# Altium schematic sheet main.SchDoc: 33c3 Heißer Draht
size Legal; Organization: Niklas Fauth; Revision: V1.0; SheetNumber: 1; SheetTotal: 1; File: bla
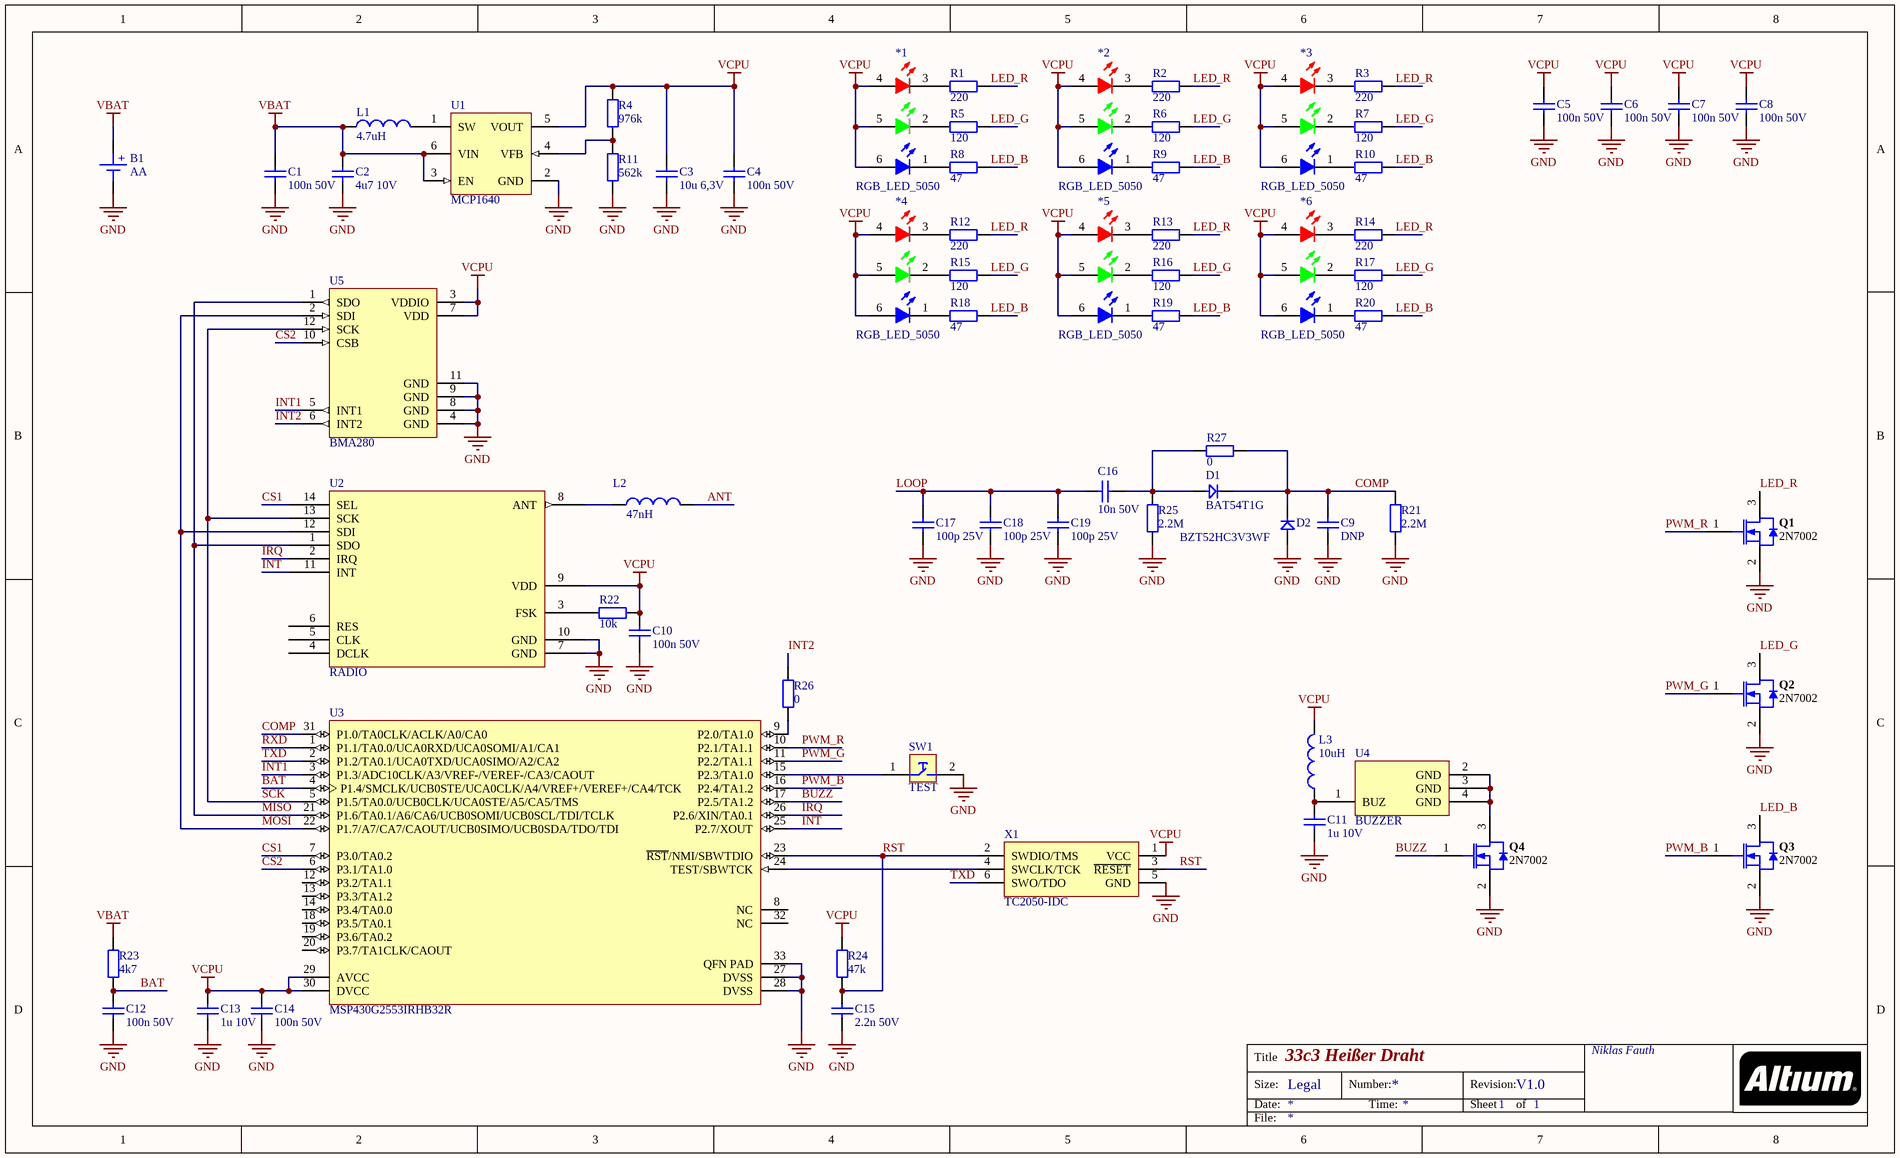
[diagram p0: main.SchDoc]

## Parts
*1  RGB_LED_5050  [plcc6]
*2  RGB_LED_5050  [plcc6]
*3  RGB_LED_5050  [plcc6]
*4  RGB_LED_5050  [plcc6]
*5  RGB_LED_5050  [plcc6]
*6  RGB_LED_5050  [plcc6]
B1  AA  [AA-HOLDER]
C1  100n 50V  [C-0603-M]
C2  4u7 10V  [C-0603-H]
C3  10u 6,3V  [C-0603-H]
C4  100n 50V  [C-0603-M]
C5  100n 50V  [C-0603-M]
C6  100n 50V  [C-0603-M]
C7  100n 50V  [C-0603-M]
C8  100n 50V  [C-0603-M]
C9  DNP  [C-0603-H]
C10  100n 50V  [C-0603-M]
C11  1u 10V  [C-0603-H]
C12  100n 50V  [C-0603-M]
C13  1u 10V  [C-0603-H]
C14  100n 50V  [C-0603-M]
C15  2.2n 50V  [C-0603-H]
C16  10n 50V  [C-0603-H]
C17  100p 25V  [C-0603-M]
C18  100p 25V  [C-0603-M]
C19  100p 25V  [C-0603-M]
D1  BAT54T1G  [SOD123]
D2  BZT52HC3V3WF  [SOD123]
L1  4.7uH  [SRN4012]
L2  47nH  [C-0603-M]
L3  10uH  [R-0805]
Q1  2N7002  [INF-PG-SOT23_M]
Q2  2N7002  [INF-PG-SOT23_M]
Q3  2N7002  [INF-PG-SOT23_M]
Q4  2N7002  [INF-PG-SOT23_M]
R1  220  [R-0603-M]
R2  220  [R-0603-M]
R3  220  [R-0603-M]
R4  976k  [R-0603-M]
R5  120  [R-0603-M]
R6  120  [R-0603-M]
R7  120  [R-0603-M]
R8  47  [R-0603-M]
R9  47  [R-0603-M]
R10  47  [R-0603-M]
R11  562k  [R-0603-M]
R12  220  [R-0603-M]
R13  220  [R-0603-M]
R14  220  [R-0603-M]
R15  120  [R-0603-M]
R16  120  [R-0603-M]
R17  120  [R-0603-M]
R18  47  [R-0603-M]
R19  47  [R-0603-M]
R20  47  [R-0603-M]
R21  2.2M  [R-0603-H]
R22  10k  [R-0603-M]
R23  4k7  [R-0603-H]
R24  47k  [R-0603-H]
R25  2.2M  [R-0603-H]
R26  0  [R-0603-M]
R27  0  [R-0603-M]
SW1  TEST  [switch-mini-ALPS]
U1  MCP1640  [SOT23-6]
U2  RADIO  [RFM12]
U3  MSP430G2553IRHB32R  [RHB0032E_V]
U4  BUZZER  [PIEZO]
U5  BMA280  [LGA12C50P4X4_203X203X80]
X1  TC2050-IDC  [TC2030-IDC-NL]

## Nets
GND: B1.1 C1.1 C2.1 C3.1 C4.1 C5.1 C6.1 C7.1 C8.1 C9.1 C10.1 C11.1 C12.1 C13.1 C14.1 C15.1 C17.1 C18.1 C19.1 D2.1(an) Q1.2(SOURCE) Q2.2(SOURCE) Q3.2(SOURCE) Q4.2(SOURCE) R11.1 R21.1 R25.1 SW1.2 U1.2(GND) U2.7(GND) U2.10(GND) U3.27(DVSS) U3.28(DVSS) U3.33(QFN_PAD) U5.4(GND) U5.8(GND) U5.9(GND) U5.11(GND) X1.5(GND)
VBAT: B1.2 C1.2 C2.2 L1.1 R23.2 U1.3(EN) U1.6(VIN)
VCPU: *1.4(A) *1.5(A) *1.6(A) *2.4(A) *2.5(A) *2.6(A) *3.4(A) *3.5(A) *3.6(A) *4.4(A) *4.5(A) *4.6(A) *5.4(A) *5.5(A) *5.6(A) *6.4(A) *6.5(A) *6.6(A) C3.2 C4.2 C5.2 C6.2 C7.2 C8.2 C10.2 C13.2 C14.2 L3.2 R4.2 R22.2 R24.2 U1.5(VOUT) U2.9(VDD) U3.29(AVCC) U3.30(DVCC) U5.3(VDDIO) U5.7(VDD) X1.1(VCC)
ANT: L2.2
BAT: C12.2 R23.1 U3.4(P1.4/SMCLK/UCB0STE/UCA0CLK/A4/VREF+/VEREF+/CA4/TCK)
BUZZ: Q4.1(GATE) U3.17(P2.5/TA1.2)
COMP: C9.2 D1.2(kt) D2.2(kt) R21.2 R27.2 U3.31(P1.0/TA0CLK/ACLK/A0/CA0)
CS1: U2.14(SEL) U3.7(P3.0/TA0.2)
CS2: U3.6(P3.1/TA1.0) U5.10(CSB)
INT: U2.11(INT) U3.25(P2.7/XOUT)
INT1: U3.3(P1.3/ADC10CLK/A3/VREF-/VEREF-/CA3/CAOUT) U5.5(INT1)
INT2: R26.2 U5.6(INT2)
IRQ: U2.2(IRQ) U3.26(P2.6/XIN/TA0.1)
LED_B: Q3.3(DRAIN) R8.2 R9.2 R10.2 R18.2 R19.2 R20.2
LED_G: Q2.3(DRAIN) R5.2 R6.2 R7.2 R15.2 R16.2 R17.2
LED_R: Q1.3(DRAIN) R1.2 R2.2 R3.2 R12.2 R13.2 R14.2
LOOP: C16.1 C17.2 C18.2 C19.2
MISO: U2.1(SDO) U3.21(P1.6/TA0.1/A6/CA6/UCB0SOMI/UCB0SCL/TDI/TCLK) U5.1(SDO)
MOSI: U2.12(SDI) U3.22(P1.7/A7/CA7/CAOUT/UCB0SIMO/UCB0SDA/TDO/TDI) U5.2(SDI)
PWM_B: Q3.1(GATE) U3.16(P2.4/TA1.2)
PWM_G: Q2.1(GATE) U3.11(P2.2/TA1.1)
PWM_R: Q1.1(GATE) U3.10(P2.1/TA1.1)
RST: C15.2 R24.1 U3.23(~{RST}/NMI/SBWTDIO) X1.2(SWDIO/TMS) X1.3(~{RESET})
RXD: U3.1(P1.1/TA0.0/UCA0RXD/UCA0SOMI/A1/CA1)
SCK: U2.13(SCK) U3.5(P1.5/TA0.0/UCB0CLK/UCA0STE/A5/CA5/TMS) U5.12(SCK)
TXD: U3.2(P1.2/TA0.1/UCA0TXD/UCA0SIMO/A2/CA2) X1.6(SWO/TDO)
Net*1_1: *1.1(K) R8.1
Net*1_2: *1.2(K) R5.1
Net*1_3: *1.3(K) R1.1
Net*2_1: *2.1(K) R9.1
Net*2_2: *2.2(K) R6.1
Net*2_3: *2.3(K) R2.1
Net*3_1: *3.1(K) R10.1
Net*3_2: *3.2(K) R7.1
Net*3_3: *3.3(K) R3.1
Net*4_1: *4.1(K) R18.1
Net*4_2: *4.2(K) R15.1
Net*4_3: *4.3(K) R12.1
Net*5_1: *5.1(K) R19.1
Net*5_2: *5.2(K) R16.1
Net*5_3: *5.3(K) R13.1
Net*6_1: *6.1(K) R20.1
Net*6_2: *6.2(K) R17.1
Net*6_3: *6.3(K) R14.1
NetC11_2: C11.2 L3.1 U4.1(BUZ)
NetC16_2: C16.2 D1.1(an) R25.2 R27.1
NetL1_2: L1.2 U1.1(SW)
NetL2_1: L2.1 U2.8(ANT)
NetQ4_3: Q4.3(DRAIN) U4.2(GND) U4.3(GND) U4.4(GND)
NetR4_1: R4.1 R11.2 U1.4(VFB)
NetR22_1: R22.1 U2.3(FSK)
NetR26_1: R26.1 U3.9(P2.0/TA1.0)
NetSW1_1: SW1.1 U3.15(P2.3/TA1.0)
NetU3_24: U3.24(TEST/SBWTCK) X1.4(SWCLK/TCK)

Not connected (* = marked no-connect by the designer): U2 4(DCLK) 5(CLK) 6(RES); U3 8(NC) 12(P3.2/TA1.1) 13(P3.3/TA1.2) 14(P3.4/TA0.0) 18(P3.5/TA0.1) 19(P3.6/TA0.2) 20(P3.7/TA1CLK/CAOUT) 32(NC)

## Notes on the sheet
- Title
- Size:
- Date:
- Legal
- Number:
- Time:
- Revision:
- Sheet
- of
- File:
- (in symbol AA-Batt-Holder) +

## Library data of the parts
B1 = AA-Batt-Holder: Batt Holder AA; Supplier 1: Reichelt; Supplier Part Number 1: HALTER 1XAAP
C1 C4-C8 C10 C12 C14 = C-0603-100n-50V: Capacitor 100n 50V; Supplier 1: Mouser; Supplier Part Number 1: 80-C0603C104K5RAUTO
C2 = C-0603-4u7-10V: Capacitor 4.7uF 10V; Supplier 1: Mouser; Supplier Part Number 1: 80-C0603C475K8P
C3 = C-0603-10u-6,3V: Capacitor 10uF 6,3V; Supplier 1: Mouser; Supplier Part Number 1: 80-C0603C106M9P
C9 C16 = C-0603-10n-50V: Capacitor 10nF 50V; Supplier 1: Mouser; Supplier Part Number 1: 80-C0603C103K5RAC
C11 C13 = C-0603-1u-10V: Capacitor 1uF 10V; Supplier 1: Mouser; Supplier Part Number 1: 80-C0603C105K8P
C15 = C-0603-2n2-50V: Capacitor 2.2n 50V; Supplier 1: Mouser; Supplier Part Number 1: 80-C0603C222F5G
C17-C19 = C-0603-100p-25V: Capacitor 100pF 25V; Supplier 1: Mouser; Supplier Part Number 1: 80-C0201C101K3G
D2 = BAT54T1G: Supplier 1: Mouser; Supplier Part Number 1: 863-BAT54T1G
L1 = L-SRN4012TA-4R7M: SRN4012TA-4R7M; Supplier 1: Mouser; Supplier Part Number 1: 652-SRN4012TA-4R7M
L2 = L-0603-47nH: Supplier 1: Mouser; Supplier Part Number 1: 652-CI160808-47NJ
L3 = L-0805-10uH: L 0805 10uH; Supplier 1: Digi-Key; Supplier Part Number 1: 445-6762-1-ND
Q1-Q4 = CMP-1149-00026-1: N-Channel OptiMOS Small-Signal-Transistor, 60 V VDS, 0.3 A ID, -55 to 150 degC, PG-SOT23, Reel, Green; Manufacturer: Infineon; RDS (on) (max) (@4.5V): 4,000 mOhm; VDS (max): 60 V; IDpuls (max): 1.2Â A; QG: 0.4Â nC; RDS (on) (max): 3,000 mOhm; RthJA (max): 250 K/W; ID (max): 0.3Â A; VGS(th) (max): 2.5Â V; VGS(th) (min): 1.5Â V; Green: TRUE; Ptot (max): 0.5Â W; PackageDescription: 3-Pin Small Outline Transistor Package, 2.9 x 1.3 mm Body, 0.95 mm Pitch; Halogen-free: TRUE; ComponentLink2Description: Datasheet; ComponentLink1URL: http://www.infineon.com/; Packing: Reel; DatasheetVersion: Rev. 2.4; PartNumber: 2N7002; PackageReference: PG-SOT23; PackageVersion: Apr-08; ComponentLink3URL: http://www.infineon.com/dgdl/SOT23-Package_Overview.pdf?folderId=db3a30431936bc4b0119532290053c66&fileId=db3a30431936bc4b0119533468123c85; ComponentLink1Description: Manufacturer URL; Mounting Technology: Surface Mount; ComponentLink3Description: Package Specification; ComponentLink2URL: http://www.infineon.com/dgdl/2N7002_Rev2.4.pdf?folderId=db3a3043156fd573011622e10b5c1f67&fileId=db3a304319bc939a0119c2a9461e79e6
R1-R3 R12-R14 = R-0603-220: Resistor 220; Supplier 1: Digi-Key; Supplier Part Number 1: 541-220HTR-ND
R4 = R-0603-976k: Resistor 976k; Resistance: 976k; Supplier 1: Mouser; Supplier Part Number 1: 71-CRCW0603-976K-E3
R5-R7 R15-R17 = R-0603-120: Resistor 120; Supplier 1: Mouser; Supplier Part Number 1: 71-CRCW0603-120-E3
R8-R10 R18-R20 = R-0603-47: Resistor 47; Supplier 1: Mouser; Supplier Part Number 1: 71-CRCW060347R0FKEB
R11 = R-0603-562k: Resistor 562k; Resistance: 562k; Supplier 1: Mouser; Supplier Part Number 1: 71-CRCW0603-562K-E3
R21 R25 = R-0603-2M2: Resistor 2.2M; Supplier 1: Mouser; Supplier Part Number 1: 71-CRCW06032M20FKEA
R22 = R-0603-10k: Resistor 10k; Supplier 1: Mouser; Supplier Part Number 1: 71-CRCW0603-10K-E3
R23 = R-0603-4k7: Resistor 4k7; Supplier 1: Mouser; Supplier Part Number 1: 71-CRCW0603-4.7K-E3
R24 = R-0603-47k: Resistor 4k7; Supplier 1: Mouser; Supplier Part Number 1: 71-CRCW060347K0FKEB
R26 R27 = R-0603-0: Resistor 0; Supplier 1: Mouser; Supplier Part Number 1: 71-CRCW0603-0-E3; Resistance: 0
SW1 = Switch-mini-ALPS: SKQYAAE010; Supplier 1: Mouser; Supplier Part Number 1: 688-SKQYAA
U1 = MCP1640: aaa to 3.3V; Supplier 1: Mouser; Supplier Part Number 1: 579-MCP1640TI/CHY
U2 = RFM12: Sub 1GHz Radio Module
U3 = CMP-0365-01202-2: 16 MHz Mixed Signal Microcontroller with 16 KB Flash, 512 B SRAM and 24 GPIOs, -40 to 85 degC, 32-pin QFN (RHB), Green (RoHS & no Sb/Br); Manufacturer: Texas Instruments; Temp Sensor: Yes; Flash(KB): 16; ADC Channels: 8; ADC: 10-bit SAR; SubFamily: Value Line; GPIO: 24; USCI_B (I2C & SPI): 1; Timers - 16-bit: 2; SRAM(B): 512; PackageReference: RHB0032E; Comparators: Yes; Code_JEDEC: MO-220; ComponentLink3Description: Package Specification; DatasheetVersion: SLAS735G; ComponentLink1Description: Manufacturer URL; PackageVersion: 4204326/D; Cap touch I/O: Yes; ComponentLink2URL: http://www.ti.com/general/docs/lit/getliterature.tsp?genericPartNumber=MSP430G2553&fileType=pdf; ComponentLink2Description: Datasheet; Eco-Plan: Green (RoHS & no Sb/Br); Frequency(MHz): 16; PartNumber: MSP430G2553IRHB32R; Mounting Technology: Surface Mount; Brown Out Reset: Yes; ComponentLink1URL: http://www.ti.com/; Watchdog: Yes; ComponentLink3URL: http://www.ti.com/lit/ml/mpqf130c/mpqf130c.pdf; PackageDescription: 32-Pin Plastic Flat Pack, Body 5 x 5 mm, Pitch 0.5 mm; USCI_A (UART/LIN/IrDA/SPI): 1
U4 = PIEZO-1411A03: Supplier 1: Reichelt; Supplier Part Number 1: SMD-1411A03
X1 = TAG-Connect-SWD: TC2050-IDC SWD
*1-*6 = RGB_LED_5050: Supplier 1: Mouser; Supplier Part Number 1: 941-V6AFKBCKNPRGJ7A3
D1 = BAT54T1G: Supplier 1: Mouser; Supplier Part Number 1: 863-BAT54T1G
U5 = BMA280: Supplier 1: Mouser